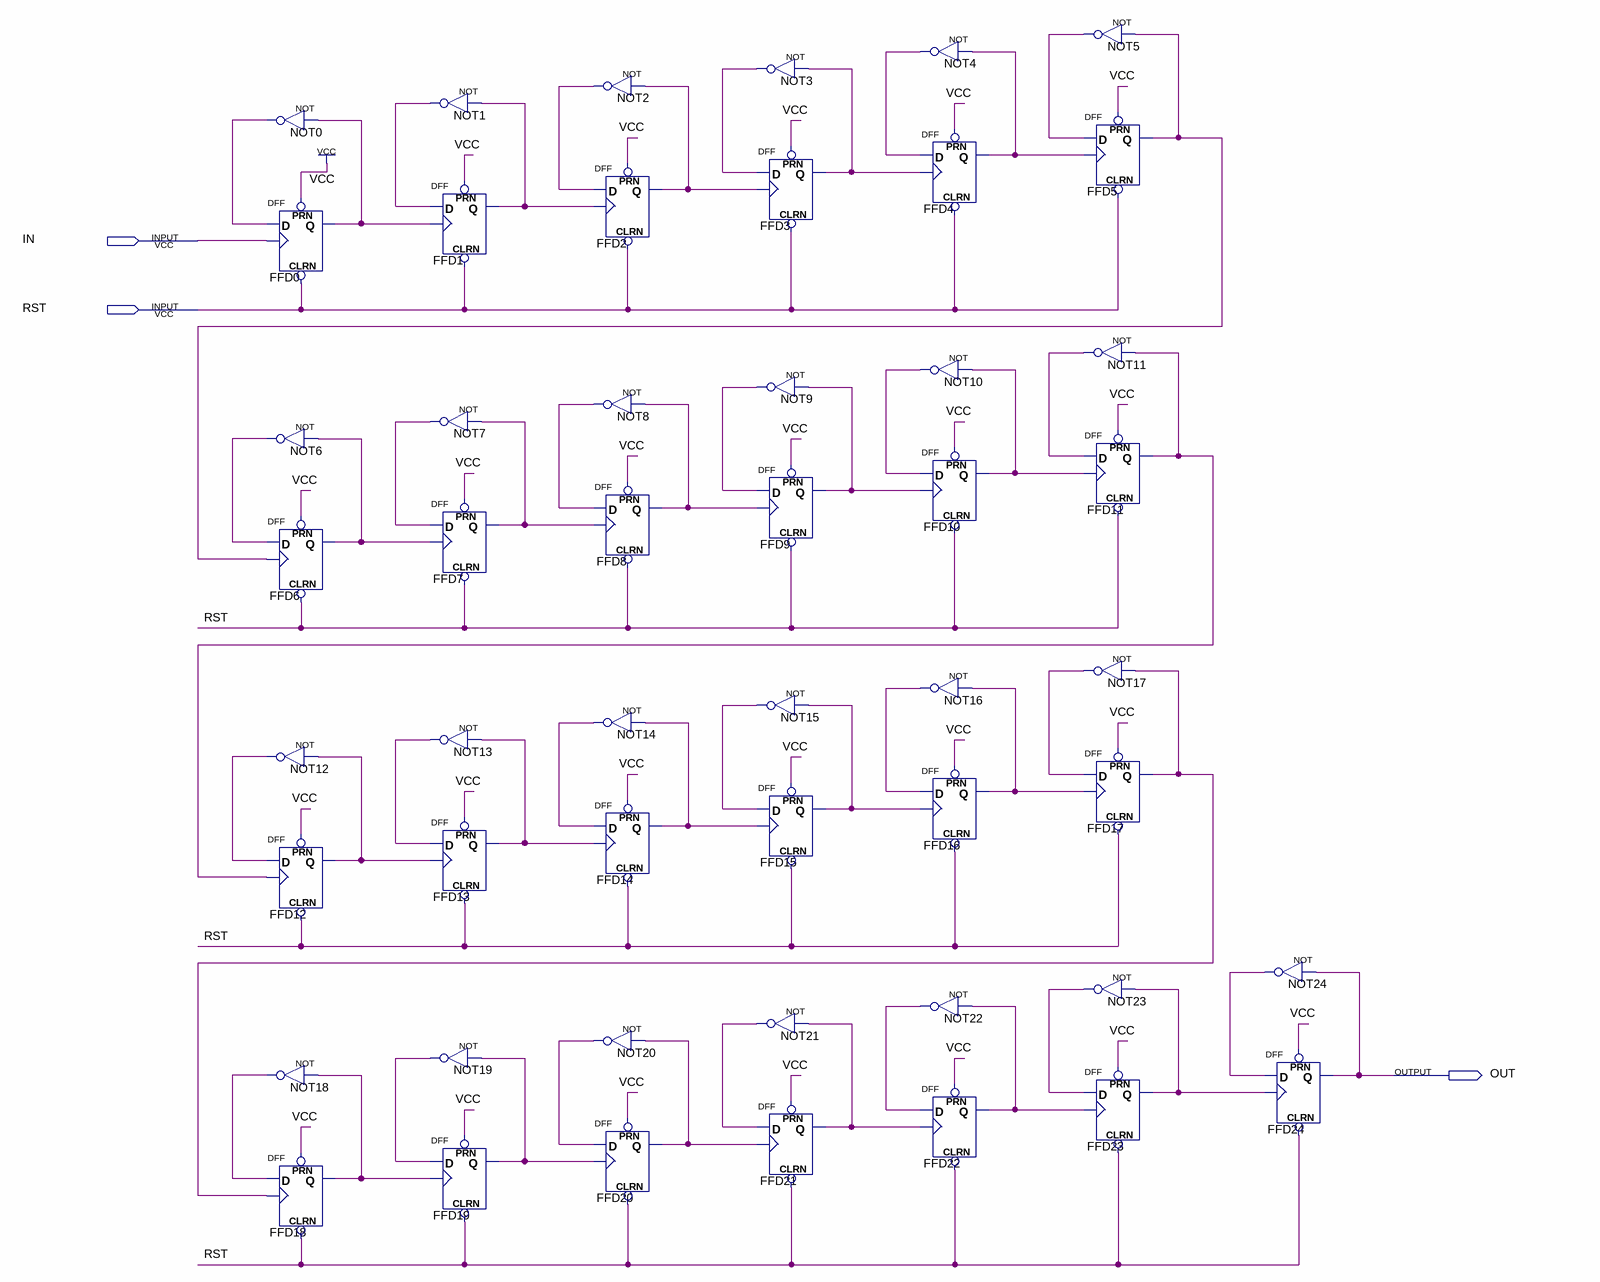
[diagram p0: schematic sheet]
// Quartus schematic FREQ_DIV.bdf as structural Verilog: 50 symbols, 3 pins
module FREQ_DIV (
  input  IN,
  input  RST,
  output OUT
);

  wire FFD0_q, FFD1_q, FFD2_q, FFD3_q, FFD4_q, FFD5_q, FFD6_q, FFD7_q, FFD8_q, FFD9_q, FFD10_q, FFD11_q,
       FFD12_q, FFD13_q, FFD14_q, FFD15_q, FFD16_q, FFD17_q, FFD18_q, FFD19_q, FFD20_q, FFD21_q, FFD22_q,
       FFD23_q, NOT0_out, NOT1_out, NOT2_out, NOT3_out, NOT4_out, NOT5_out, NOT6_out, NOT7_out, NOT8_out,
       NOT9_out, NOT10_out, NOT11_out, NOT12_out, NOT13_out, NOT14_out, NOT15_out, NOT16_out, NOT17_out,
       NOT18_out, NOT19_out, NOT20_out, NOT21_out, NOT22_out, NOT23_out, NOT24_out;

  not NOT0 (NOT0_out, FFD0_q);
  DFF FFD0 (.CLRN(RST), .CLK(IN), .D(NOT0_out), .PRN(1'b1), .Q(FFD0_q));
  not NOT6 (NOT6_out, FFD6_q);
  DFF FFD6 (.CLRN(RST), .CLK(FFD5_q), .D(NOT6_out), .PRN(1'b1), .Q(FFD6_q));
  not NOT12 (NOT12_out, FFD12_q);
  DFF FFD12 (.CLRN(RST), .CLK(FFD11_q), .D(NOT12_out), .PRN(1'b1), .Q(FFD12_q));
  not NOT18 (NOT18_out, FFD18_q);
  DFF FFD18 (.CLRN(RST), .CLK(FFD17_q), .D(NOT18_out), .PRN(1'b1), .Q(FFD18_q));
  not NOT1 (NOT1_out, FFD1_q);
  DFF FFD1 (.CLRN(RST), .CLK(FFD0_q), .D(NOT1_out), .PRN(1'b1), .Q(FFD1_q));
  not NOT7 (NOT7_out, FFD7_q);
  DFF FFD7 (.CLRN(RST), .CLK(FFD6_q), .D(NOT7_out), .PRN(1'b1), .Q(FFD7_q));
  not NOT13 (NOT13_out, FFD13_q);
  DFF FFD13 (.CLRN(RST), .CLK(FFD12_q), .D(NOT13_out), .PRN(1'b1), .Q(FFD13_q));
  not NOT19 (NOT19_out, FFD19_q);
  DFF FFD19 (.CLRN(RST), .CLK(FFD18_q), .D(NOT19_out), .PRN(1'b1), .Q(FFD19_q));
  not NOT2 (NOT2_out, FFD2_q);
  DFF FFD2 (.CLRN(RST), .CLK(FFD1_q), .D(NOT2_out), .PRN(1'b1), .Q(FFD2_q));
  not NOT8 (NOT8_out, FFD8_q);
  DFF FFD8 (.CLRN(RST), .CLK(FFD7_q), .D(NOT8_out), .PRN(1'b1), .Q(FFD8_q));
  not NOT14 (NOT14_out, FFD14_q);
  DFF FFD14 (.CLRN(RST), .CLK(FFD13_q), .D(NOT14_out), .PRN(1'b1), .Q(FFD14_q));
  not NOT20 (NOT20_out, FFD20_q);
  DFF FFD20 (.CLRN(RST), .CLK(FFD19_q), .D(NOT20_out), .PRN(1'b1), .Q(FFD20_q));
  not NOT3 (NOT3_out, FFD3_q);
  DFF FFD3 (.CLRN(RST), .CLK(FFD2_q), .D(NOT3_out), .PRN(1'b1), .Q(FFD3_q));
  not NOT9 (NOT9_out, FFD9_q);
  DFF FFD9 (.CLRN(RST), .CLK(FFD8_q), .D(NOT9_out), .PRN(1'b1), .Q(FFD9_q));
  not NOT15 (NOT15_out, FFD15_q);
  DFF FFD15 (.CLRN(RST), .CLK(FFD14_q), .D(NOT15_out), .PRN(1'b1), .Q(FFD15_q));
  not NOT21 (NOT21_out, FFD21_q);
  DFF FFD21 (.CLRN(RST), .CLK(FFD20_q), .D(NOT21_out), .PRN(1'b1), .Q(FFD21_q));
  not NOT4 (NOT4_out, FFD4_q);
  DFF FFD4 (.CLRN(RST), .CLK(FFD3_q), .D(NOT4_out), .PRN(1'b1), .Q(FFD4_q));
  not NOT10 (NOT10_out, FFD10_q);
  DFF FFD10 (.CLRN(RST), .CLK(FFD9_q), .D(NOT10_out), .PRN(1'b1), .Q(FFD10_q));
  not NOT16 (NOT16_out, FFD16_q);
  DFF FFD16 (.CLRN(RST), .CLK(FFD15_q), .D(NOT16_out), .PRN(1'b1), .Q(FFD16_q));
  not NOT22 (NOT22_out, FFD22_q);
  DFF FFD22 (.CLRN(RST), .CLK(FFD21_q), .D(NOT22_out), .PRN(1'b1), .Q(FFD22_q));
  not NOT5 (NOT5_out, FFD5_q);
  DFF FFD5 (.CLRN(RST), .CLK(FFD4_q), .D(NOT5_out), .PRN(1'b1), .Q(FFD5_q));
  not NOT11 (NOT11_out, FFD11_q);
  DFF FFD11 (.CLRN(RST), .CLK(FFD10_q), .D(NOT11_out), .PRN(1'b1), .Q(FFD11_q));
  not NOT17 (NOT17_out, FFD17_q);
  DFF FFD17 (.CLRN(RST), .CLK(FFD16_q), .D(NOT17_out), .PRN(1'b1), .Q(FFD17_q));
  not NOT23 (NOT23_out, FFD23_q);
  DFF FFD23 (.CLRN(RST), .CLK(FFD22_q), .D(NOT23_out), .PRN(1'b1), .Q(FFD23_q));
  not NOT24 (NOT24_out, OUT);
  DFF FFD24 (.CLRN(RST), .CLK(FFD23_q), .D(NOT24_out), .PRN(1'b1), .Q(OUT));
endmodule
